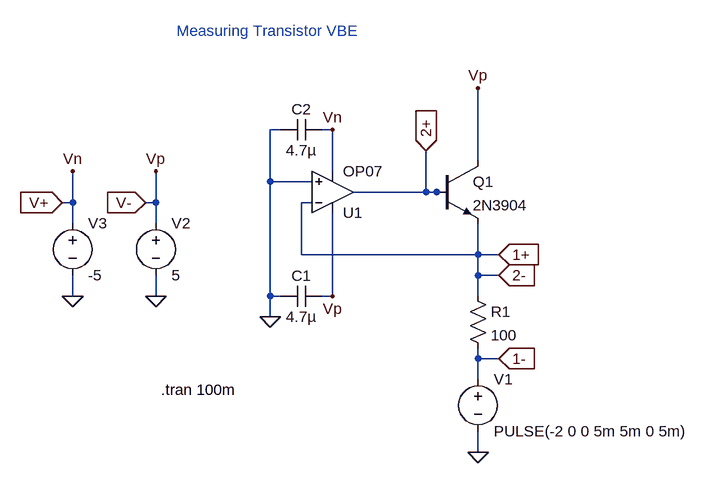
[diagram p0: schematic meas_vbe.asc]
meas_vbe.asc, the LTspice schematic file:
Version 4
SHEET 1 880 680
WIRE 32 -368 16 -368
WIRE 112 -368 96 -368
WIRE 336 -320 336 -432
WIRE 112 -304 112 -368
WIRE 16 -288 16 -368
WIRE 80 -288 16 -288
WIRE 256 -272 256 -336
WIRE 256 -272 144 -272
WIRE 272 -272 256 -272
WIRE 288 -272 272 -272
WIRE -288 -256 -288 -304
WIRE -288 -256 -304 -256
WIRE -160 -256 -160 -304
WIRE -160 -256 -176 -256
WIRE 80 -256 64 -256
WIRE -288 -224 -288 -256
WIRE -160 -224 -160 -256
WIRE 64 -176 64 -256
WIRE 336 -176 336 -224
WIRE 336 -176 64 -176
WIRE 368 -176 336 -176
WIRE 336 -144 336 -176
WIRE 368 -144 336 -144
WIRE -288 -112 -288 -144
WIRE -160 -112 -160 -144
WIRE 16 -112 16 -288
WIRE 32 -112 16 -112
WIRE 112 -112 112 -240
WIRE 112 -112 96 -112
WIRE 336 -112 336 -144
WIRE 16 -80 16 -112
WIRE 336 -16 336 -32
WIRE 368 -16 336 -16
WIRE 336 16 336 -16
WIRE 336 128 336 96
FLAG 336 128 0
FLAG 16 -80 0
FLAG -160 -112 0
FLAG -288 -112 0
FLAG -160 -304 Vp
FLAG -288 -304 Vn
FLAG 112 -112 Vp
FLAG 112 -368 Vn
FLAG -304 -256 V+
IOPIN -304 -256 In
FLAG -176 -256 V-
IOPIN -176 -256 In
FLAG 336 -432 Vp
FLAG 256 -336 2+
IOPIN 256 -336 In
FLAG 368 -176 1+
IOPIN 368 -176 In
FLAG 368 -144 2-
IOPIN 368 -144 In
FLAG 368 -16 1-
IOPIN 368 -16 In
SYMBOL voltage 336 0 R0
WINDOW 123 0 0 Left 0
WINDOW 39 0 0 Left 0
SYMATTR InstName V1
SYMATTR Value PULSE(-2 0 0 5m 5m 0 5m)
SYMBOL res 320 -128 R0
SYMATTR InstName R1
SYMATTR Value 100
SYMBOL OP07 112 -208 M180
SYMATTR InstName U1
SYMBOL cap 96 -128 R90
WINDOW 0 0 32 VBottom 2
WINDOW 3 32 32 VTop 2
SYMATTR InstName C1
SYMATTR Value 4.7µ
SYMBOL cap 96 -384 R90
WINDOW 0 0 32 VBottom 2
WINDOW 3 32 32 VTop 2
SYMATTR InstName C2
SYMATTR Value 4.7µ
SYMBOL voltage -160 -240 R0
WINDOW 123 0 0 Left 0
WINDOW 39 0 0 Left 0
SYMATTR InstName V2
SYMATTR Value 5
SYMBOL voltage -288 -240 R0
WINDOW 123 0 0 Left 0
WINDOW 39 0 0 Left 0
SYMATTR InstName V3
SYMATTR Value -5
SYMBOL npn 272 -320 R0
SYMATTR InstName Q1
SYMATTR Value 2N3904
TEXT -152 32 Left 2 !.tran 100m
TEXT -128 -520 Left 2 ;Measuring Transistor VBE

The netlist it stands for:
* meas_vbe.asc
V1 1- 0 PULSE(-2 0 0 5m 5m 0 5m)
R1 2- 1- 100
XU1 0 2- V- V+ 2+ LT1001  ; OP07, pins In+ In- V+ V- OUT
C1 V- 0 4.7µ
C2 V+ 0 4.7µ
V2 V- 0 5
V3 V+ 0 -5
Q1 V- 2+ 2- 0 2N3904
.model NPN NPN
.model PNP PNP
.lib standard.bjt
.tran 100m
* Measuring Transistor VBE
.lib LTC.lib
.backanno
.end